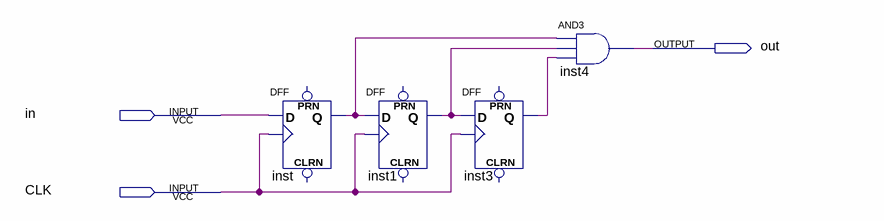
[diagram p0: schematic sheet]
// Quartus schematic debounce.bdf as structural Verilog: 4 symbols, 3 pins
module debounce (
  input  in,
  input  CLK,
  output out
);

  wire inst1_q, inst3_q, inst_q;

  DFF inst (.CLK(CLK), .D(in), .Q(inst_q));  // open: CLRN, PRN
  DFF inst1 (.CLK(CLK), .D(inst_q), .Q(inst1_q));  // open: CLRN, PRN
  DFF inst3 (.CLK(CLK), .D(inst1_q), .Q(inst3_q));  // open: CLRN, PRN
  and inst4 (out, inst_q, inst1_q, inst3_q);
endmodule
